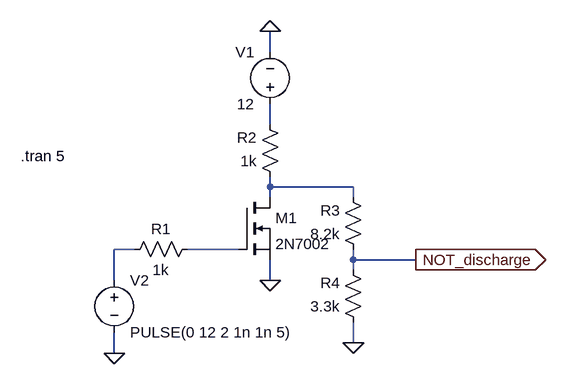
[diagram p0: schematic Draft2.asc]
Draft2.asc, the LTspice schematic file:
Version 4
SHEET 1 880 680
WIRE 368 112 368 80
WIRE 368 224 368 192
WIRE 368 320 368 304
WIRE 496 320 368 320
WIRE 368 336 368 320
WIRE 496 336 496 320
WIRE 160 416 128 416
WIRE 320 416 240 416
WIRE 496 432 496 416
WIRE 592 432 496 432
WIRE 496 448 496 432
WIRE 128 464 128 416
WIRE 368 464 368 432
WIRE 496 560 496 528
WIRE 128 576 128 544
FLAG 128 576 0
FLAG 368 80 0
FLAG 496 560 0
FLAG 368 464 0
FLAG 592 432 NOT_discharge
IOPIN 592 432 Out
SYMBOL voltage 368 208 R180
WINDOW 0 24 96 Left 2
WINDOW 3 24 16 Left 2
SYMATTR InstName V1
SYMATTR Value 12
SYMBOL voltage 128 448 R0
SYMATTR InstName V2
SYMATTR Value PULSE(0 12 2 1n 1n 5)
SYMBOL Res 256 400 R90
WINDOW 0 0 56 VBottom 2
WINDOW 3 32 56 VTop 2
SYMATTR InstName R1
SYMATTR Value 1k
SYMBOL Res 384 320 R180
WINDOW 0 36 76 Left 2
WINDOW 3 36 40 Left 2
SYMATTR InstName R2
SYMATTR Value 1k
SYMBOL Res 512 432 R180
WINDOW 0 36 76 Left 2
WINDOW 3 36 40 Left 2
SYMATTR InstName R3
SYMATTR Value 8.2k
SYMBOL Res 512 544 R180
WINDOW 0 36 76 Left 2
WINDOW 3 36 40 Left 2
SYMATTR InstName R4
SYMATTR Value 3.3k
SYMBOL nmos 320 336 R0
SYMATTR InstName M1
SYMATTR Value 2N7002
TEXT -16 272 Left 2 !.tran 5

The netlist it stands for:
* Draft2.asc
V1 N001 0 12
V2 N003 0 PULSE(0 12 2 1n 1n 5)
R1 N004 N003 1k
R2 N002 N001 1k
R3 NOT_discharge N002 8.2k
R4 0 NOT_discharge 3.3k
M1 N002 N004 0 0 2N7002
.model NMOS NMOS
.model PMOS PMOS
.lib standard.mos
.tran 5
.backanno
.end